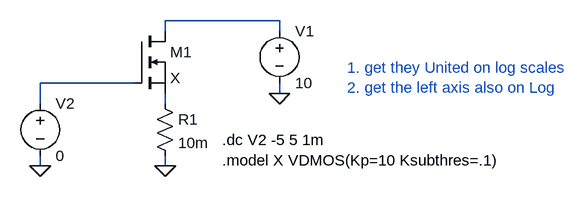
[diagram p0: schematic Draft1.asc]
Draft1.asc, the LTspice schematic file:
Version 4
SHEET 1 884 680
WIRE 400 144 224 144
WIRE 224 160 224 144
WIRE 400 160 400 144
WIRE 176 240 32 240
WIRE 400 256 400 240
WIRE 32 272 32 240
WIRE 224 272 224 256
WIRE 32 368 32 352
WIRE 224 368 224 352
FLAG 224 368 0
FLAG 400 256 0
FLAG 32 368 0
SYMBOL nmos 176 160 R0
SYMATTR InstName M1
SYMATTR Value X
SYMBOL voltage 400 144 R0
SYMATTR InstName V1
SYMATTR Value 10
SYMBOL voltage 32 256 R0
WINDOW 123 0 0 Left 0
WINDOW 39 0 0 Left 0
SYMATTR InstName V2
SYMATTR Value 0
SYMBOL res 208 256 R0
SYMATTR InstName R1
SYMATTR Value 10m
TEXT 312 328 Left 2 !.dc V2 -5 5 1m\n.model X VDMOS(Kp=10 Ksubthres=.1)
TEXT 504 216 Left 2 ;1. get they United on log scales\n2. get the left axis also on Log

The netlist it stands for:
* Draft1.asc
M1 N001 N002 N003 N003 X
V1 N001 0 10
V2 N002 0 0
R1 N003 0 10m
.model NMOS NMOS
.model PMOS PMOS
.lib standard.mos
.dc V2 -5 5 1m
.model X VDMOS(Kp=10 Ksubthres=.1)
* 1. get they United on log scales
* 2. get the left axis also on Log
.backanno
.end